# EAGLE design NIRx_EDDC_v03_wide (EAGLE 7.7.0)
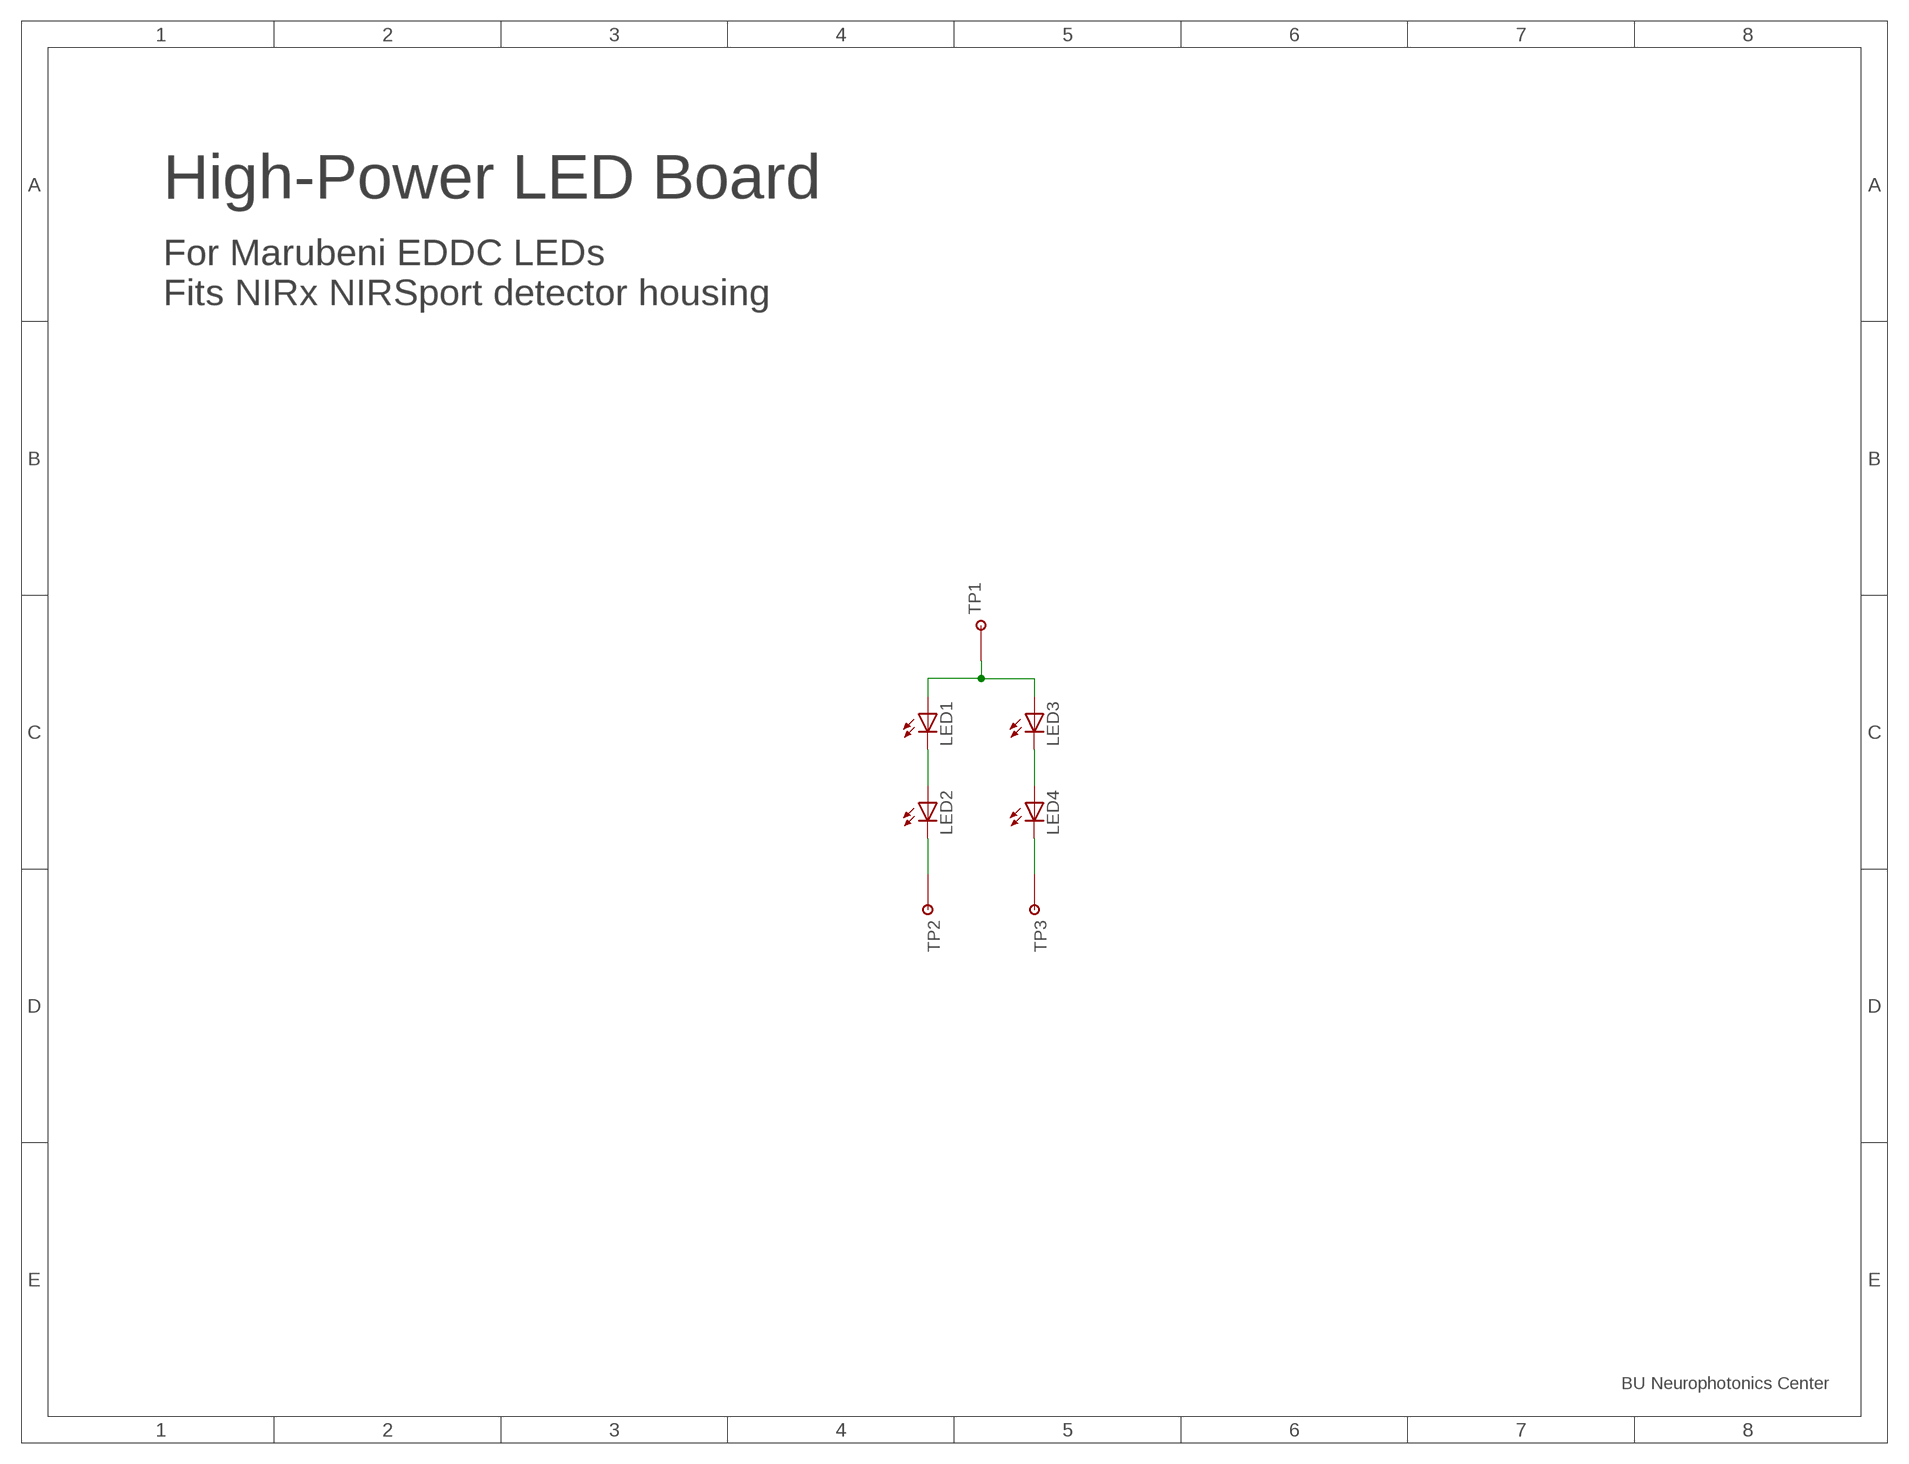
[diagram p0: schematic, sheet 1]

## Parts
LED1  LED_EDCC  [MARUBENI_EDCC]
LED2  LED_EDCC  [MARUBENI_EDCC]
LED3  LED_EDCC  [MARUBENI_EDCC]
LED4  LED_EDCC  [MARUBENI_EDCC]
TP1  TESTPOINT_PADMEDIUM  [TESTPAD_MEDIUM]
TP2  TESTPOINT_PADMEDIUM  [TESTPAD_MEDIUM]
TP3  TESTPOINT_PADMEDIUM  [TESTPAD_MEDIUM]

## Nets
76: LED2.C TP2.P$1
85: LED4.C TP3.P$1
AN: LED1.A LED3.A TP1.P$1
I76: LED1.C LED2.A
I85: LED3.C LED4.A

## Notes on the sheet
- High-Power LED Board
- For Marubeni EDDC LEDs
  Fits NIRx NIRSport detector housing
- BU Neurophotonics Center

## Library data of the parts
LED1-LED4 = MyLib:LED: LEDs Standard schematic elements and footprints for 5mm, 3mm, 1206, and 0603 sized LEDs. 5mm - Spark Fun Electronics SKU : COM-00529 (and others)
TP1-TP3 = MyLib:TESTPOINT

## Board
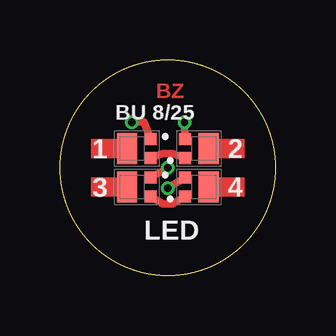
[diagram p1: board, top side]
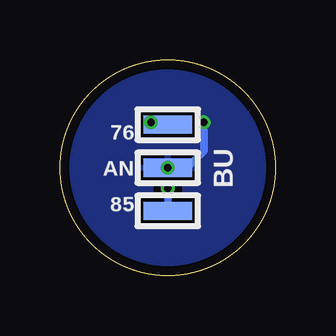
[diagram p2: board, bottom side, seen from below]

Size 9 x 9 mm. Coordinates in mm from the lower left corner, seen from the top.
Outline: circle at 4.5,4.5 radius 4.5
Copper layers (1*16): Top 0.035559375mm / dielectric 1.6mm / Bottom 0.035559375mm
Design rules "oshpark-2layer": minimum track width 6mil, minimum drill 10mil, track to track 6mil, track to pad 6mil, pad to pad 6mil, via to via 6mil, smd to smd 6mil, copper to edge 15mil, drill to drill 6mil, minimum pad ring 5mil, minimum via ring 5mil, stop-mask expansion 2.5mil, vias tented up to drill 12mil, thermal gap 10mil

### Footprints (pad centres in the part's own frame; a part is rotated, then mirrored left to right if it is on the bottom)
MARUBENI_EDCC = smd 0.5 x 0.5: A 0.4,-0.58; C -0.4,-0.58 | smd 1.3 x 0.85: PAD 0,0.4
TESTPAD_MEDIUM = smd 2.032 x 0.762: P$1 0,0

### Placement (x,y rotation side)
LED1  3.2,5.3 90 top
LED2  5.8,5.3 270 top
LED3  3.2,3.7 90 top
LED4  5.8,3.7 270 top
TP1  4.5,4.5 180 bottom
TP2  4.5,6.3 180 bottom
TP3  4.5,2.7 180 bottom

### Tracks (layer width: path | path; a pad name or v marks a point on that pad's centre or on a via)
76  (via drill 0.3)
  Top 0.305: v5.2,6.4 LED2.C
  Bottom 0.305: TP2.P$1 v5.2,6.4
85  (via drill 0.3)
  Top 0.305: v4.5,3.65 LED4.C
  Bottom 0.305: v4.5,3.65 TP3.P$1
AN  (via drill 0.3)
  Top 0.305: LED3.A TP1.P$1 | v3,6.4 3.5,6.4 LED1.A
  Bottom 0.305: TP1.P$1 3.7,4.5 3,5.2 v3,6.4
  other vias: 4.5,4.5
  pour Bottom (isolate 0.305): -0.3,-0.3 9.3,-0.3 9.3,9.3 -0.3,9.3
I76
  Top 0.305: LED1.C 4.3,5.1 4.7,5.1 LED2.A
I85
  Top 0.305: LED3.C 4.3,3 4.7,3 LED4.A
(copper drawn outside any net)
  shapes: Top area x4

### Text on the board
Top: BZ
tPlace: BU 8/25 | 1 | 3 | 2 | 4 | LED
bPlace: 76 | BU | AN | 85